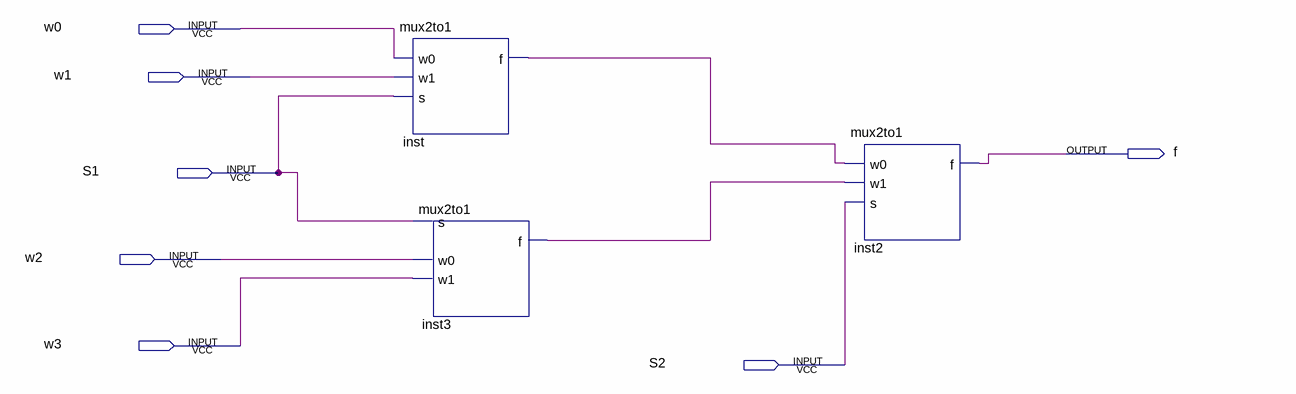
[diagram p0: schematic sheet]
// Quartus schematic muxModified.bdf as structural Verilog: 3 symbols, 7 pins
module muxModified (
  input  w0,
  input  w1,
  input  S1,
  input  w2,
  input  w3,
  input  S2,
  output f
);

  wire inst3_f, inst_f;

  mux2to1 inst (.w0(w0), .w1(w1), .s(S1), .f(inst_f));
  mux2to1 inst3 (.w0(w2), .w1(w3), .s(S1), .f(inst3_f));
  mux2to1 inst2 (.w0(inst_f), .w1(inst3_f), .s(S2), .f(f));
endmodule
